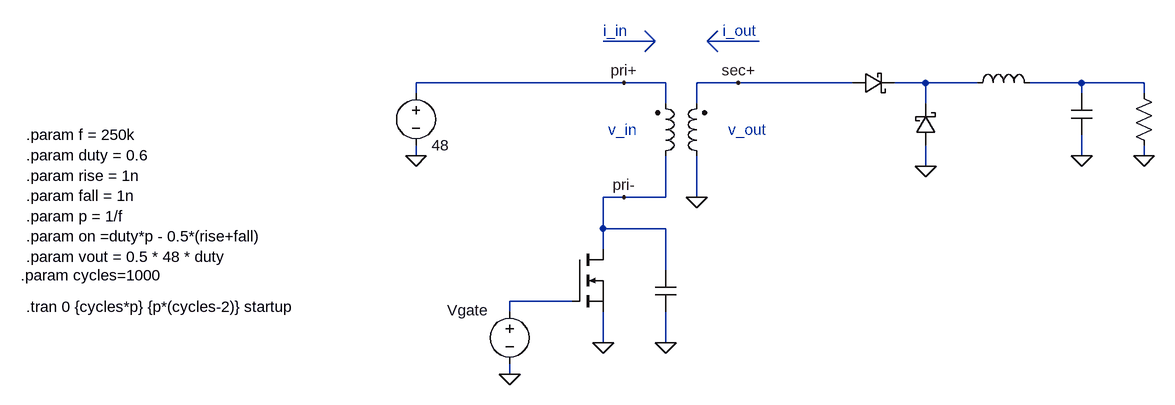
[diagram p0: schematic forward_picture.asc]
forward_picture.asc, the LTspice schematic file:
Version 4
SHEET 1 1880 832
WIRE -1920 -2064 -2240 -2064
WIRE -1856 -2064 -1920 -2064
WIRE -1744 -2064 -1808 -2064
WIRE -1568 -2064 -1744 -2064
WIRE -1456 -2064 -1504 -2064
WIRE -1376 -2064 -1456 -2064
WIRE -1216 -2064 -1296 -2064
WIRE -1120 -2064 -1216 -2064
WIRE -2240 -2048 -2240 -2064
WIRE -1216 -2048 -1216 -2064
WIRE -1120 -2048 -1120 -2064
WIRE -1856 -2032 -1856 -2064
WIRE -1808 -2032 -1808 -2064
WIRE -1456 -2032 -1456 -2064
WIRE -2240 -1952 -2240 -1968
WIRE -1216 -1952 -1216 -1984
WIRE -1120 -1952 -1120 -1968
WIRE -1456 -1936 -1456 -1968
WIRE -1920 -1888 -1952 -1888
WIRE -1856 -1888 -1856 -1952
WIRE -1856 -1888 -1920 -1888
WIRE -1808 -1888 -1808 -1952
WIRE -1952 -1840 -1952 -1888
WIRE -1856 -1840 -1952 -1840
WIRE -1952 -1808 -1952 -1840
WIRE -1856 -1776 -1856 -1840
WIRE -2000 -1728 -2096 -1728
WIRE -2096 -1712 -2096 -1728
WIRE -1952 -1664 -1952 -1712
WIRE -1856 -1664 -1856 -1712
WIRE -2096 -1616 -2096 -1632
FLAG -2240 -1952 0
FLAG -1808 -1888 0
FLAG -1456 -1936 0
FLAG -1216 -1952 0
FLAG -1120 -1952 0
FLAG -2096 -1616 0
FLAG -1952 -1664 0
FLAG -1856 -1664 0
FLAG -1920 -2064 pri+
FLAG -1920 -1888 pri-
FLAG -1744 -2064 sec+
SYMBOL voltage -2240 -2064 R0
WINDOW 0 24 16 Invisible 2
SYMATTR InstName Vin
SYMATTR Value 48
SYMBOL nmos -2000 -1808 R0
WINDOW 3 59 71 Invisible 2
WINDOW 0 56 32 Invisible 2
SYMATTR Value BSC320N20NS3
SYMATTR InstName Q1
SYMBOL ind2 -1872 -1936 M180
WINDOW 0 -7 70 Invisible 2
WINDOW 3 -4 35 Invisible 2
SYMATTR InstName L1
SYMATTR Value 300µ
SYMATTR Type ind
SYMATTR SpiceLine Rser=36m
SYMBOL ind2 -1792 -1936 R180
WINDOW 0 -7 71 Invisible 2
WINDOW 3 -5 38 Invisible 2
SYMATTR InstName L2
SYMATTR Value 90µ
SYMATTR Type ind
SYMATTR SpiceLine Rser=15m
SYMBOL schottky -1472 -1968 M180
WINDOW 0 24 64 Invisible 2
WINDOW 3 24 0 Invisible 2
SYMATTR InstName D1
SYMATTR Value MBR20100CT
SYMATTR Description Diode
SYMATTR Type diode
SYMBOL schottky -1568 -2080 M90
WINDOW 0 0 32 Invisible 2
WINDOW 3 32 32 Invisible 2
SYMATTR InstName D2
SYMATTR Value MBR20100CT
SYMATTR Description Diode
SYMATTR Type diode
SYMBOL ind -1392 -2048 R270
WINDOW 0 32 56 Invisible 2
WINDOW 3 5 56 Invisible 2
SYMATTR InstName L3
SYMATTR Value 22µ
SYMATTR SpiceLine Rser=16m
SYMBOL cap -1232 -2048 R0
WINDOW 0 24 8 Invisible 2
WINDOW 3 24 56 Invisible 2
SYMATTR InstName C4
SYMATTR Value 100µ
SYMATTR SpiceLine Rser=10m
SYMBOL cap -1872 -1776 R0
WINDOW 0 24 8 Invisible 2
WINDOW 3 24 56 Invisible 2
SYMATTR InstName C5
SYMATTR Value 240p
SYMBOL res -1136 -2064 R0
WINDOW 0 36 40 Invisible 2
WINDOW 3 36 76 Invisible 2
SYMATTR InstName Rload
SYMATTR Value 2
SYMBOL voltage -2096 -1728 R0
WINDOW 0 -96 14 Left 2
WINDOW 3 -547 61 Invisible 2
SYMATTR InstName Vgate
SYMATTR Value PULSE(0 10 {on} {rise} {fall} {on} {p} 1meg)
TEXT -3664 -4136 Invisible 2 !K1 L1 L2 1
TEXT -2840 -1720 Left 2 !.tran 0 {cycles*p} {p*(cycles-2)} startup
TEXT -2840 -1984 Left 2 !.param f = 250k\n.param duty = 0.6\n.param rise = 1n\n.param fall = 1n\n.param p = 1/f\n.param on =duty*p - 0.5*(rise+fall)\n.param vout = 0.5 * 48 * duty
TEXT -2848 -1768 Left 2 !.param cycles=1000
TEXT -1944 -1992 Left 2 ;v_in
TEXT -1760 -1992 Left 2 ;v_out
TEXT -1952 -2144 Left 2 ;i_in
TEXT -1768 -2144 Left 2 ;i_out
LINE Normal -1872 -2128 -1952 -2128
LINE Normal -1888 -2144 -1872 -2128
LINE Normal -1872 -2128 -1888 -2144
LINE Normal -1888 -2112 -1872 -2128
LINE Normal -1792 -2128 -1712 -2128
LINE Normal -1776 -2144 -1792 -2128
LINE Normal -1792 -2128 -1776 -2144
LINE Normal -1776 -2112 -1792 -2128

The netlist it stands for:
* forward_picture.asc
Vin pri+ 0 48
M§Q1 pri- N003 0 0 BSC320N20NS3
L1 pri- pri+ 300µ Rser=36m
L2 0 sec+ 90µ Rser=15m
D1 0 N001 MBR20100CT
D2 sec+ N001 MBR20100CT
L3 N001 N002 22µ Rser=16m
C4 N002 0 100µ Rser=10m
C5 pri- 0 240p
Rload N002 0 2
Vgate N003 0 PULSE(0 10 {on} {rise} {fall} {on} {p} 1meg)
.model D D
.lib standard.dio
.model NMOS NMOS
.model PMOS PMOS
.lib standard.mos
K1 L1 L2 1
.tran 0 {cycles*p} {p*(cycles-2)} startup
.param f = 250k
.param duty = 0.6
.param rise = 1n
.param fall = 1n
.param p = 1/f
.param on =duty*p - 0.5*(rise+fall)
.param vout = 0.5 * 48 * duty
.param cycles=1000
* v_in
* v_out
* i_in
* i_out
.backanno
.end